# EasyEDA schematic BIT 7.json
TITLE: TRICORE | ALU | LOGIC; REV: 1.0; Date: 2022-01-03; Sheet: 9/9; Drawn By: Koehler, Paul; Company: komed3
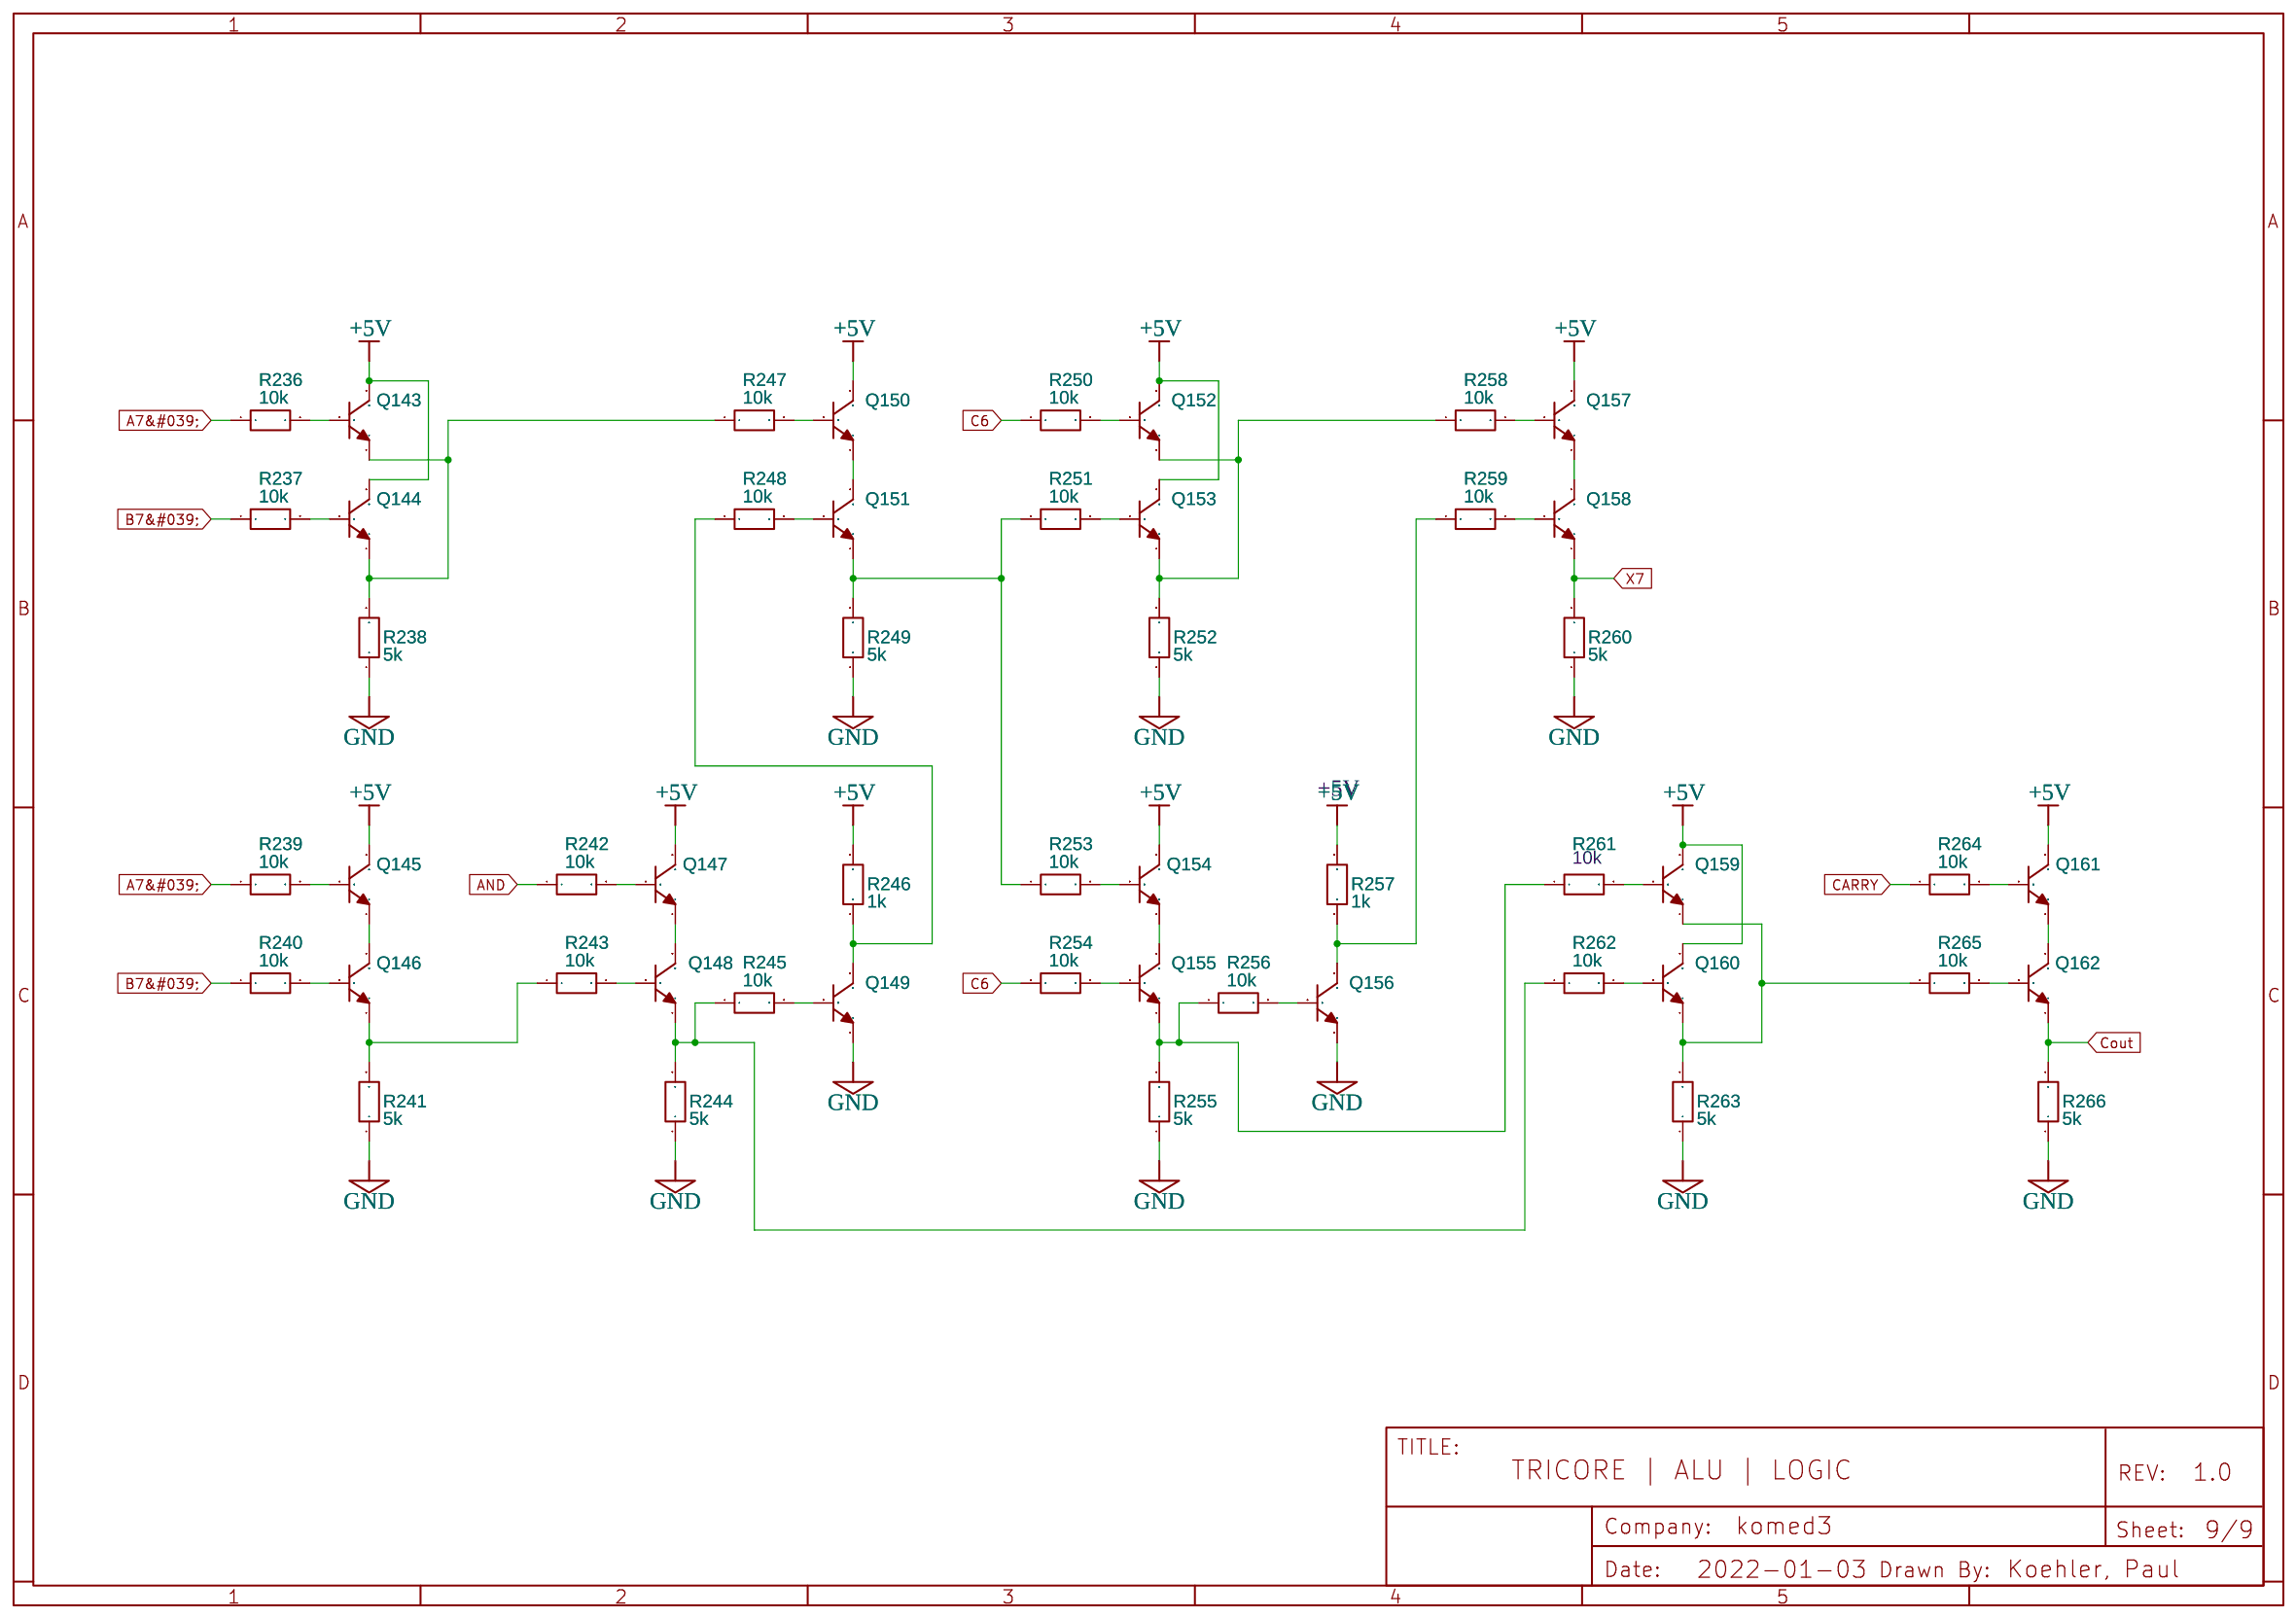
[diagram p0: schematic sheet]

## Parts
Q143  2N3904(TO-92)  [TO-92-3_L5.1-W4.1-P1.27-L]
Q144  2N3904(TO-92)  [TO-92-3_L5.1-W4.1-P1.27-L]
Q145  2N3904(TO-92)  [TO-92-3_L5.1-W4.1-P1.27-L]
Q146  2N3904(TO-92)  [TO-92-3_L5.1-W4.1-P1.27-L]
Q147  2N3904(TO-92)  [TO-92-3_L5.1-W4.1-P1.27-L]
Q148  2N3904(TO-92)  [TO-92-3_L5.1-W4.1-P1.27-L]
Q149  2N3904(TO-92)  [TO-92-3_L5.1-W4.1-P1.27-L]
Q150  2N3904(TO-92)  [TO-92-3_L5.1-W4.1-P1.27-L]
Q151  2N3904(TO-92)  [TO-92-3_L5.1-W4.1-P1.27-L]
Q152  2N3904(TO-92)  [TO-92-3_L5.1-W4.1-P1.27-L]
Q153  2N3904(TO-92)  [TO-92-3_L5.1-W4.1-P1.27-L]
Q154  2N3904(TO-92)  [TO-92-3_L5.1-W4.1-P1.27-L]
Q155  2N3904(TO-92)  [TO-92-3_L5.1-W4.1-P1.27-L]
Q156  2N3904(TO-92)  [TO-92-3_L5.1-W4.1-P1.27-L]
Q157  2N3904(TO-92)  [TO-92-3_L5.1-W4.1-P1.27-L]
Q158  2N3904(TO-92)  [TO-92-3_L5.1-W4.1-P1.27-L]
Q159  2N3904(TO-92)  [TO-92-3_L5.1-W4.1-P1.27-L]
Q160  2N3904(TO-92)  [TO-92-3_L5.1-W4.1-P1.27-L]
Q161  2N3904(TO-92)  [TO-92-3_L5.1-W4.1-P1.27-L]
Q162  2N3904(TO-92)  [TO-92-3_L5.1-W4.1-P1.27-L]
R236  10k  [R_AXIAL-0.3]
R237  10k  [R_AXIAL-0.3]
R238  5k  [R_AXIAL-0.3]
R239  10k  [R_AXIAL-0.3]
R240  10k  [R_AXIAL-0.3]
R241  5k  [R_AXIAL-0.3]
R242  10k  [R_AXIAL-0.3]
R243  10k  [R_AXIAL-0.3]
R244  5k  [R_AXIAL-0.3]
R245  10k  [R_AXIAL-0.3]
R246  1k  [R_AXIAL-0.3]
R247  10k  [R_AXIAL-0.3]
R248  10k  [R_AXIAL-0.3]
R249  5k  [R_AXIAL-0.3]
R250  10k  [R_AXIAL-0.3]
R251  10k  [R_AXIAL-0.3]
R252  5k  [R_AXIAL-0.3]
R253  10k  [R_AXIAL-0.3]
R254  10k  [R_AXIAL-0.3]
R255  5k  [R_AXIAL-0.3]
R256  10k  [R_AXIAL-0.3]
R257  1k  [R_AXIAL-0.3]
R258  10k  [R_AXIAL-0.3]
R259  10k  [R_AXIAL-0.3]
R260  5k  [R_AXIAL-0.3]
R261  R224W  [R_AXIAL-0.3]
R262  10k  [R_AXIAL-0.3]
R263  5k  [R_AXIAL-0.3]
R264  10k  [R_AXIAL-0.3]
R265  10k  [R_AXIAL-0.3]
R266  5k  [R_AXIAL-0.3]

## Library data of the parts
Q143-Q162 = 2N3904(TO-92): Supplier: LCSC; Manufacturer: SEMTECH; Manufacturer Part: 2N3904; Supplier Part: C118538; Contributor: LCEDA_Lib
R236-R266 = R_AXIAL-0.3_EU: Contributor: LCEDA_Lib

## Nets
+5V: Q143.3(C) Q144.3(C) Q145.3(C) Q147.3(C) Q150.3(C) Q152.3(C) Q153.3(C) Q154.3(C) Q157.3(C) Q159.3(C) Q160.3(C) Q161.3(C) R246.2 R257.2
GND: Q149.1(E) Q156.1(E) R238.1 R241.1 R244.1 R249.1 R252.1 R255.1 R260.1 R263.1 R266.1
A7&#039;: R236.1 R239.1
AND: R242.1
B7&#039;: R237.1 R240.1
C6: R250.1 R254.1
CARRY: R264.1
Cout: Q162.1(E) R266.2
X7: Q158.1(E) R260.2
Net-(Q143-1): Q143.1(E) Q144.1(E) R238.2 R247.1
Net-(Q143-2): Q143.2(B) R236.2
Net-(Q144-2): Q144.2(B) R237.2
Net-(Q145-1): Q145.1(E) Q146.3(C)
Net-(Q145-2): Q145.2(B) R239.2
Net-(Q146-1): Q146.1(E) R241.2 R243.1
Net-(Q146-2): Q146.2(B) R240.2
Net-(Q147-1): Q147.1(E) Q148.3(C)
Net-(Q147-2): Q147.2(B) R242.2
Net-(Q148-1): Q148.1(E) R244.2 R245.1 R262.1
Net-(Q148-2): Q148.2(B) R243.2
Net-(Q149-2): Q149.2(B) R245.2
Net-(Q149-3): Q149.3(C) R246.1 R248.1
Net-(Q150-1): Q150.1(E) Q151.3(C)
Net-(Q150-2): Q150.2(B) R247.2
Net-(Q151-1): Q151.1(E) R249.2 R251.1 R253.1
Net-(Q151-2): Q151.2(B) R248.2
Net-(Q152-1): Q152.1(E) Q153.1(E) R252.2 R258.1
Net-(Q152-2): Q152.2(B) R250.2
Net-(Q153-2): Q153.2(B) R251.2
Net-(Q154-1): Q154.1(E) Q155.3(C)
Net-(Q154-2): Q154.2(B) R253.2
Net-(Q155-1): Q155.1(E) R255.2 R256.1 R261.1
Net-(Q155-2): Q155.2(B) R254.2
Net-(Q156-2): Q156.2(B) R256.2
Net-(Q156-3): Q156.3(C) R257.1 R259.1
Net-(Q157-1): Q157.1(E) Q158.3(C)
Net-(Q157-2): Q157.2(B) R258.2
Net-(Q158-2): Q158.2(B) R259.2
Net-(Q159-1): Q159.1(E) Q160.1(E) R263.2 R265.1
Net-(Q159-2): Q159.2(B) R261.2
Net-(Q160-2): Q160.2(B) R262.2
Net-(Q161-1): Q161.1(E) Q162.3(C)
Net-(Q161-2): Q161.2(B) R264.2
Net-(Q162-2): Q162.2(B) R265.2

## Notes on the sheet
- +5V
- 10k
